# EasyEDA Pro project ProProject_LM5164 .epro

# Schematic Schematic1
Create Date: 2024-01-25; Page Name: P1; Project Name: LM5164; Schematic Name: Schematic1; Update Date: 2024-01-28; Company: 嘉立创EDA; Page Size: A4; Version: V1.0
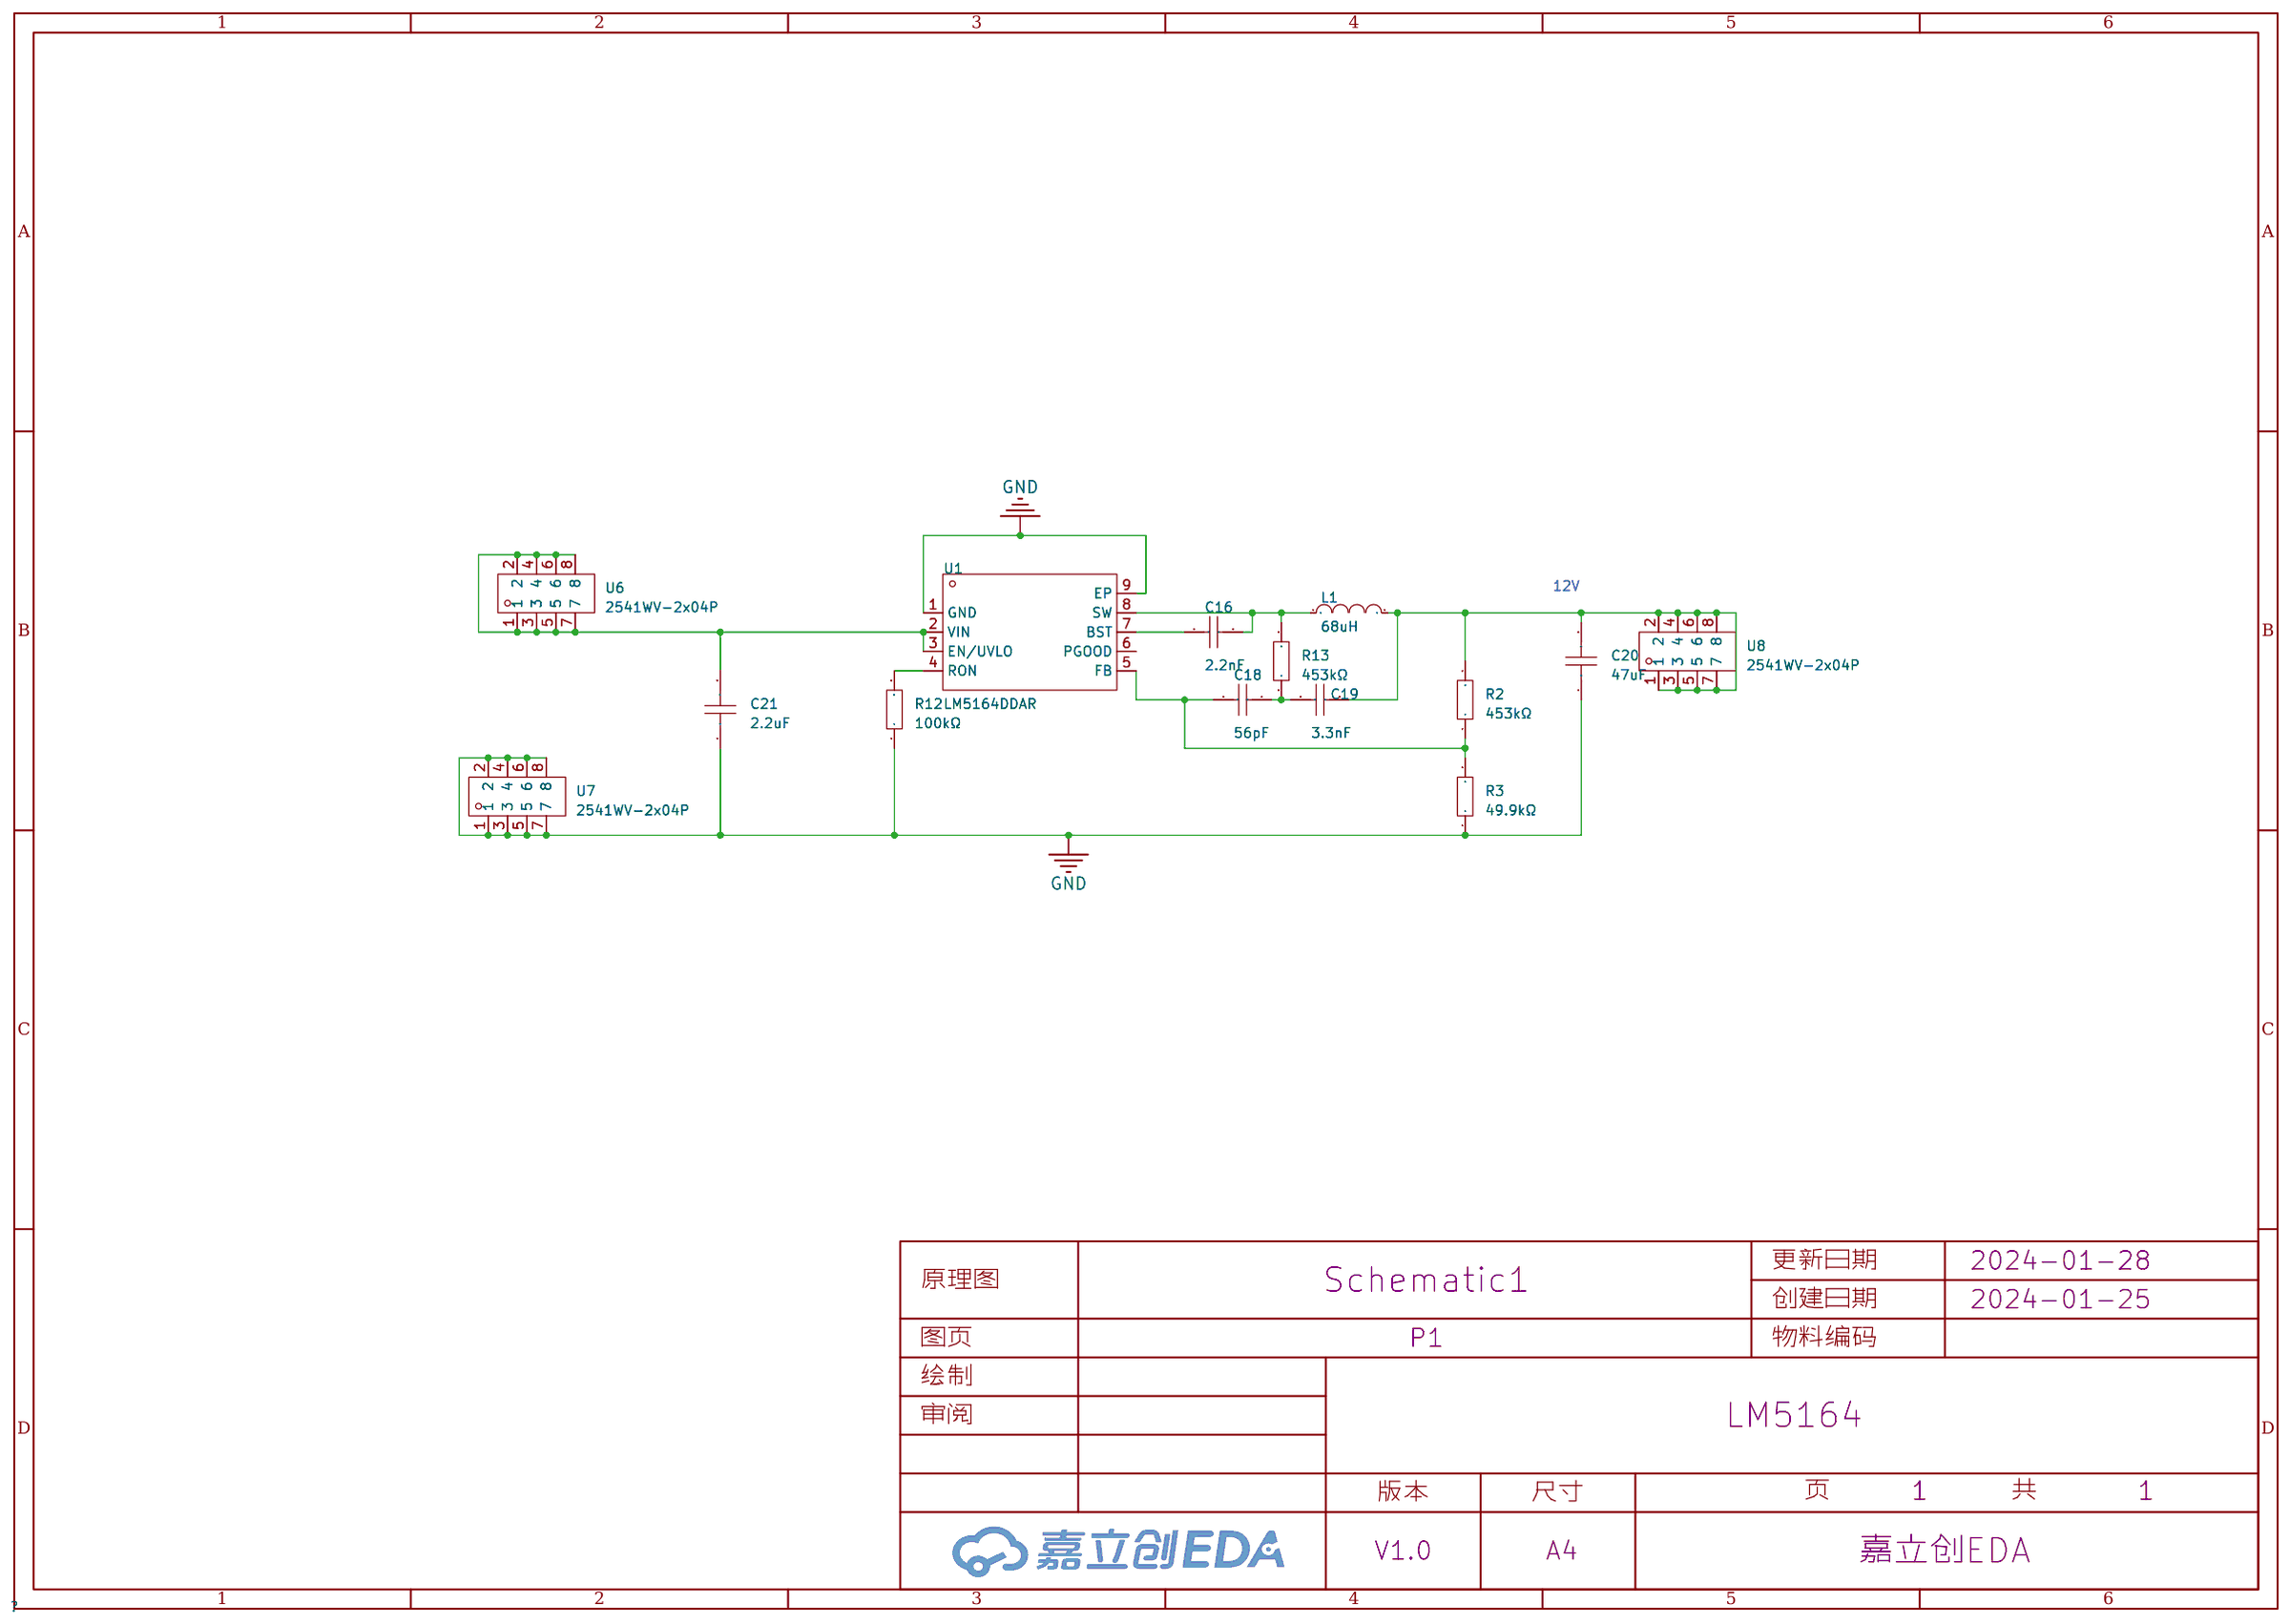
[diagram p0: schematic sheet]

## Parts
C16  2.2nF  [C0603]
C18  56pF  [C0603]
C19  3.3nF  [C0603]
C20  47uF  [C1206]
C21  2.2uF  [C1210]
L1  68uH  [IND-SMD_L12.6-W13.5]
R2  453kΩ  [R0603]
R3  49.9kΩ  [R0603]
R12  100kΩ  [R0603]
R13  453kΩ  [R0603]
U1  LM5164DDAR  [SO-8_L4.9-W3.9-P1.27-LS6.0-BL-EP]
U6  2541WV-2x04P  [HDR-TH_8P-P2.54-V-M-R2-C4-S2.54-3]
U7  2541WV-2x04P  [HDR-TH_8P-P2.54-V-M-R2-C4-S2.54-3]
U8  2541WV-2x04P  [HDR-TH_8P-P2.54-V-M-R2-C4-S2.54-3]

## Library data of the parts
C16 = 0603B222K500NT: 容值:2.2nF;精度:±10%;额定电压:50V;材质(温度系数):X7R;; LCSC Part Name: 2.2nF ±10% 50V; Supplier Part: C1604; Manufacturer: FH(风华); Supplier Footprint: 0603; JLCPCB Part Class: 基础库; Datasheet: https://atta.szlcsc.com/upload/public/pdf/source/20200305/C486355_26A10D38EF8C2A5C37091D0039909270.pdf; Supplier: LCSC; Tolerance: ±10%; Voltage Rated: 50V; Temperature Coefficient: X7R
C18 = 0603CG560J500NT: 容值:56pF;精度:±5%;额定电压:50V;材质(温度系数):C0G;; LCSC Part Name: 56pF ±5% 50V; Supplier Part: C1676; Manufacturer: FH(风华); Supplier Footprint: 0603; JLCPCB Part Class: Extended Part; Datasheet: https://atta.szlcsc.com/upload/public/pdf/source/20200305/C486355_26A10D38EF8C2A5C37091D0039909270.pdf; Supplier: LCSC; Tolerance: ±5%; Voltage Rated: 50V; Temperature Coefficient: C0G
C19 = CL10B332KB8NNNC: 容值:3.3nF;精度:±10%;额定电压:50V;材质(温度系数):X7R;; LCSC Part Name: 3.3nF ±10% 50V; Supplier Part: C1613; Manufacturer: SAMSUNG(三星); Supplier Footprint: 0603; JLCPCB Part Class: 基础库; Datasheet: https://atta.szlcsc.com/upload/public/pdf/source/20160218/1457707763339.pdf; Supplier: LCSC; Tolerance: ±10%; Voltage Rated: 50V; Temperature Coefficient: X7R
C20 = GRM31CR61E476ME44L: 容值:47uF;精度:±20%;额定电压:25V;材质(温度系数):X5R;; LCSC Part Name: 47uF ±20% 25V; Supplier Part: C403725; Manufacturer: muRata(村田); Supplier Footprint: 1206; JLCPCB Part Class: 扩展库; Datasheet: https://atta.szlcsc.com/upload/public/pdf/source/20191025/C403725_B8A8CD2FFA1F57E6FDF268BD106459D5.pdf; Supplier: LCSC; Tolerance: ±20%; Voltage Rated: 25V; Temperature Coefficient: X5R
C21 = 1210B225K101NT: 容值:2.2uF;精度:±10%;额定电压:100V;材质(温度系数):X7R;; LCSC Part Name: 2.2uF ±10% 100V; Supplier Part: C962231; Manufacturer: FH(风华); Supplier Footprint: 1210; JLCPCB Part Class: 扩展库; Datasheet: https://atta.szlcsc.com/upload/public/pdf/source/20200107/C481765_0B9ED27549D69467445AE1EDB69BAE8E.pdf; Supplier: LCSC; Tolerance: ±10%; Voltage Rated: 100V; Temperature Coefficient: X7R
L1 = FXL1360-680-M: 电感值:68uH;精度:±20%;额定电流:3A;类型:一体成型电感;饱和电流(Isat):4.5A;; LCSC Part Name: 68uH ±20% 4.5A; Supplier Part: C526032; Manufacturer: cjiang(长江微电); Supplier Footprint: SMD,12.6x13.5mm; JLCPCB Part Class: 扩展库; Datasheet: https://atta.szlcsc.com/upload/public/pdf/source/20230516/EDBB5FB099B441B256CFB4945AE848AD.pdf; Supplier: LCSC; Tolerance: ±20%; Rated Current: 3A; Type: 一体成型电感; DC Resistance (DCR): 140mΩ; Saturation Current (Isat): 4.5A
R2 R13 = 0603WAF4533T5E: 阻值:453kΩ;精度:±1%;功率:100mW;温度系数:±100ppm/℃;电阻类型:厚膜电阻;; LCSC Part Name: 453kΩ ±1% 100mW 厚膜电阻; Supplier Part: C25818; Manufacturer: UNI-ROYAL(厚声); Supplier Footprint: 0603; JLCPCB Part Class: 扩展库; Datasheet: https://atta.szlcsc.com/upload/public/pdf/source/20200306/C422600_1E6D84923E4A46A82E41ADD87F860B5C.pdf; Supplier: LCSC; Tolerance: ±1%; Power(Watts): 100mW; Overload Voltage (Max): 75V; Temperature Coefficient: ±100ppm/℃; Type: 厚膜电阻; Operating Temperature Range: -55℃~+155℃
R3 = 0603WAF4992T5E: 阻值:49.9kΩ;精度:±1%;功率:100mW;温度系数:±100ppm/℃;电阻类型:厚膜电阻;; LCSC Part Name: 49.9kΩ ±1% 100mW 厚膜电阻; Supplier Part: C23184; Manufacturer: UNI-ROYAL(厚声); Supplier Footprint: 0603; JLCPCB Part Class: Basic Part; Datasheet: https://atta.szlcsc.com/upload/public/pdf/source/20200306/C422600_1E6D84923E4A46A82E41ADD87F860B5C.pdf; Supplier: LCSC; Tolerance: ±1%; Power(Watts): 100mW; Overload Voltage (Max): 75V; Temperature Coefficient: ±100ppm/℃; Type: 厚膜电阻; Operating Temperature Range: -55℃~+155℃
R12 = RC0603FR-07100KL: 电阻类型:厚膜电阻;阻值:100kΩ;精度:±1%;功率:100mW;最大工作电压:75V;温度系数:±100ppm/℃;; LCSC Part Name: 厚膜电阻 100kΩ ±1% 100mW; Supplier Part: C14675; Manufacturer: YAGEO(国巨); Supplier Footprint: 0603; JLCPCB Part Class: Extended Part; Datasheet: https://atta.szlcsc.com/upload/public/pdf/source/20140324/1457707028752.pdf; Supplier: LCSC; Type: 厚膜电阻; Tolerance: ±1%; Power(Watts): 100mW; Overload Voltage (Max): 75V; Temperature Coefficient: ±100ppm/℃; Operating Temperature Range: -55℃~+155℃
U1 = LM5164DDAR: 功能类型:降压型;输出类型:可调;输入电压:6V~100V;输出电压:1.2V~100V;输出电流(最大值):1A;; LCSC Part Name: 降压型 输入6V~100V 输出1.2V~100V 1A; Supplier Part: C477928; Manufacturer: TI(德州仪器); Supplier Footprint: SO-8-EP; JLCPCB Part Class: 扩展库; Datasheet: https://atta.szlcsc.com/upload/public/pdf/source/20200102/C477928_A6130A40DCA2C193067E68A47DE8CF0C.pdf; Supplier: LCSC; Function: 降压型; Synchronous Rectification: 是; Output Type: 可调; Number of Outputs: 1; Topology: 降压式; Input Voltage: 6V~100V; Output Voltage: 1.2V~100V; Output Current (Max): 1A; Switching Frequency: 1MHz; Operating Temperature: -40℃~+150℃@(TJ)
U6-U8 = 2541WV-2x04P: 插针结构:2x4P;间距:2.54mm;安装类型:直插;排数:双排;总PIN位数:8P;配合针长度:6mm;塑高:2.54mm;端接针长度:3mm;; Supplier Part: C5383105; Manufacturer: HanElectricity(瀚源); Supplier Footprint: 插件,P=2.54mm; Datasheet: https://atta.szlcsc.com/upload/public/pdf/source/20230330/E6AE37B56C45D0CDA24B058754300644.pdf; Supplier: LCSC; Pin Structure: 2x4P; Pitch: 2.54mm; Mounting Type: 直插; Number of Rows: 双排; Number of Pins: 8P; Length of Mating Pin: 6mm; Insulation Height: 2.54mm; Length of End Connection Pin: 3mm

## Nets
GND: C20.1 C21.1 R3.1 R12.1 U1.1(GND) U1.9(EP) U7.1 U7.2 U7.3 U7.4 U7.5 U7.6 U7.7 U7.8
$1N232: C16.1 U1.7(BST)
$1N237: C16.2 L1.1 R13.2 U1.8(SW)
$1N1019: R12.2 U1.4(RON)
$1N4223: C18.2 C19.1 R13.1
$1N4227: C18.1 R2.1 R3.2 U1.5(FB)
$1N4823: C21.2 U1.2(VIN) U1.3(EN/UVLO) U6.1 U6.2 U6.3 U6.4 U6.5 U6.6 U6.7 U6.8
$1N5083: C19.2 C20.2 L1.2 R2.2 U8.1 U8.2 U8.3 U8.4 U8.5 U8.6 U8.7 U8.8

Not connected (* = marked no-connect by the designer): U1 6(PGOOD)

## Notes on the sheet
- 12V

# Schematic Schematic2
Create Date: 2024-03-01; Page Name: P1; Project Name: LM5164; Schematic Name: Schematic2; Update Date: 2024-03-01; Company: 嘉立创EDA; Page Size: A4; Version: V1.0
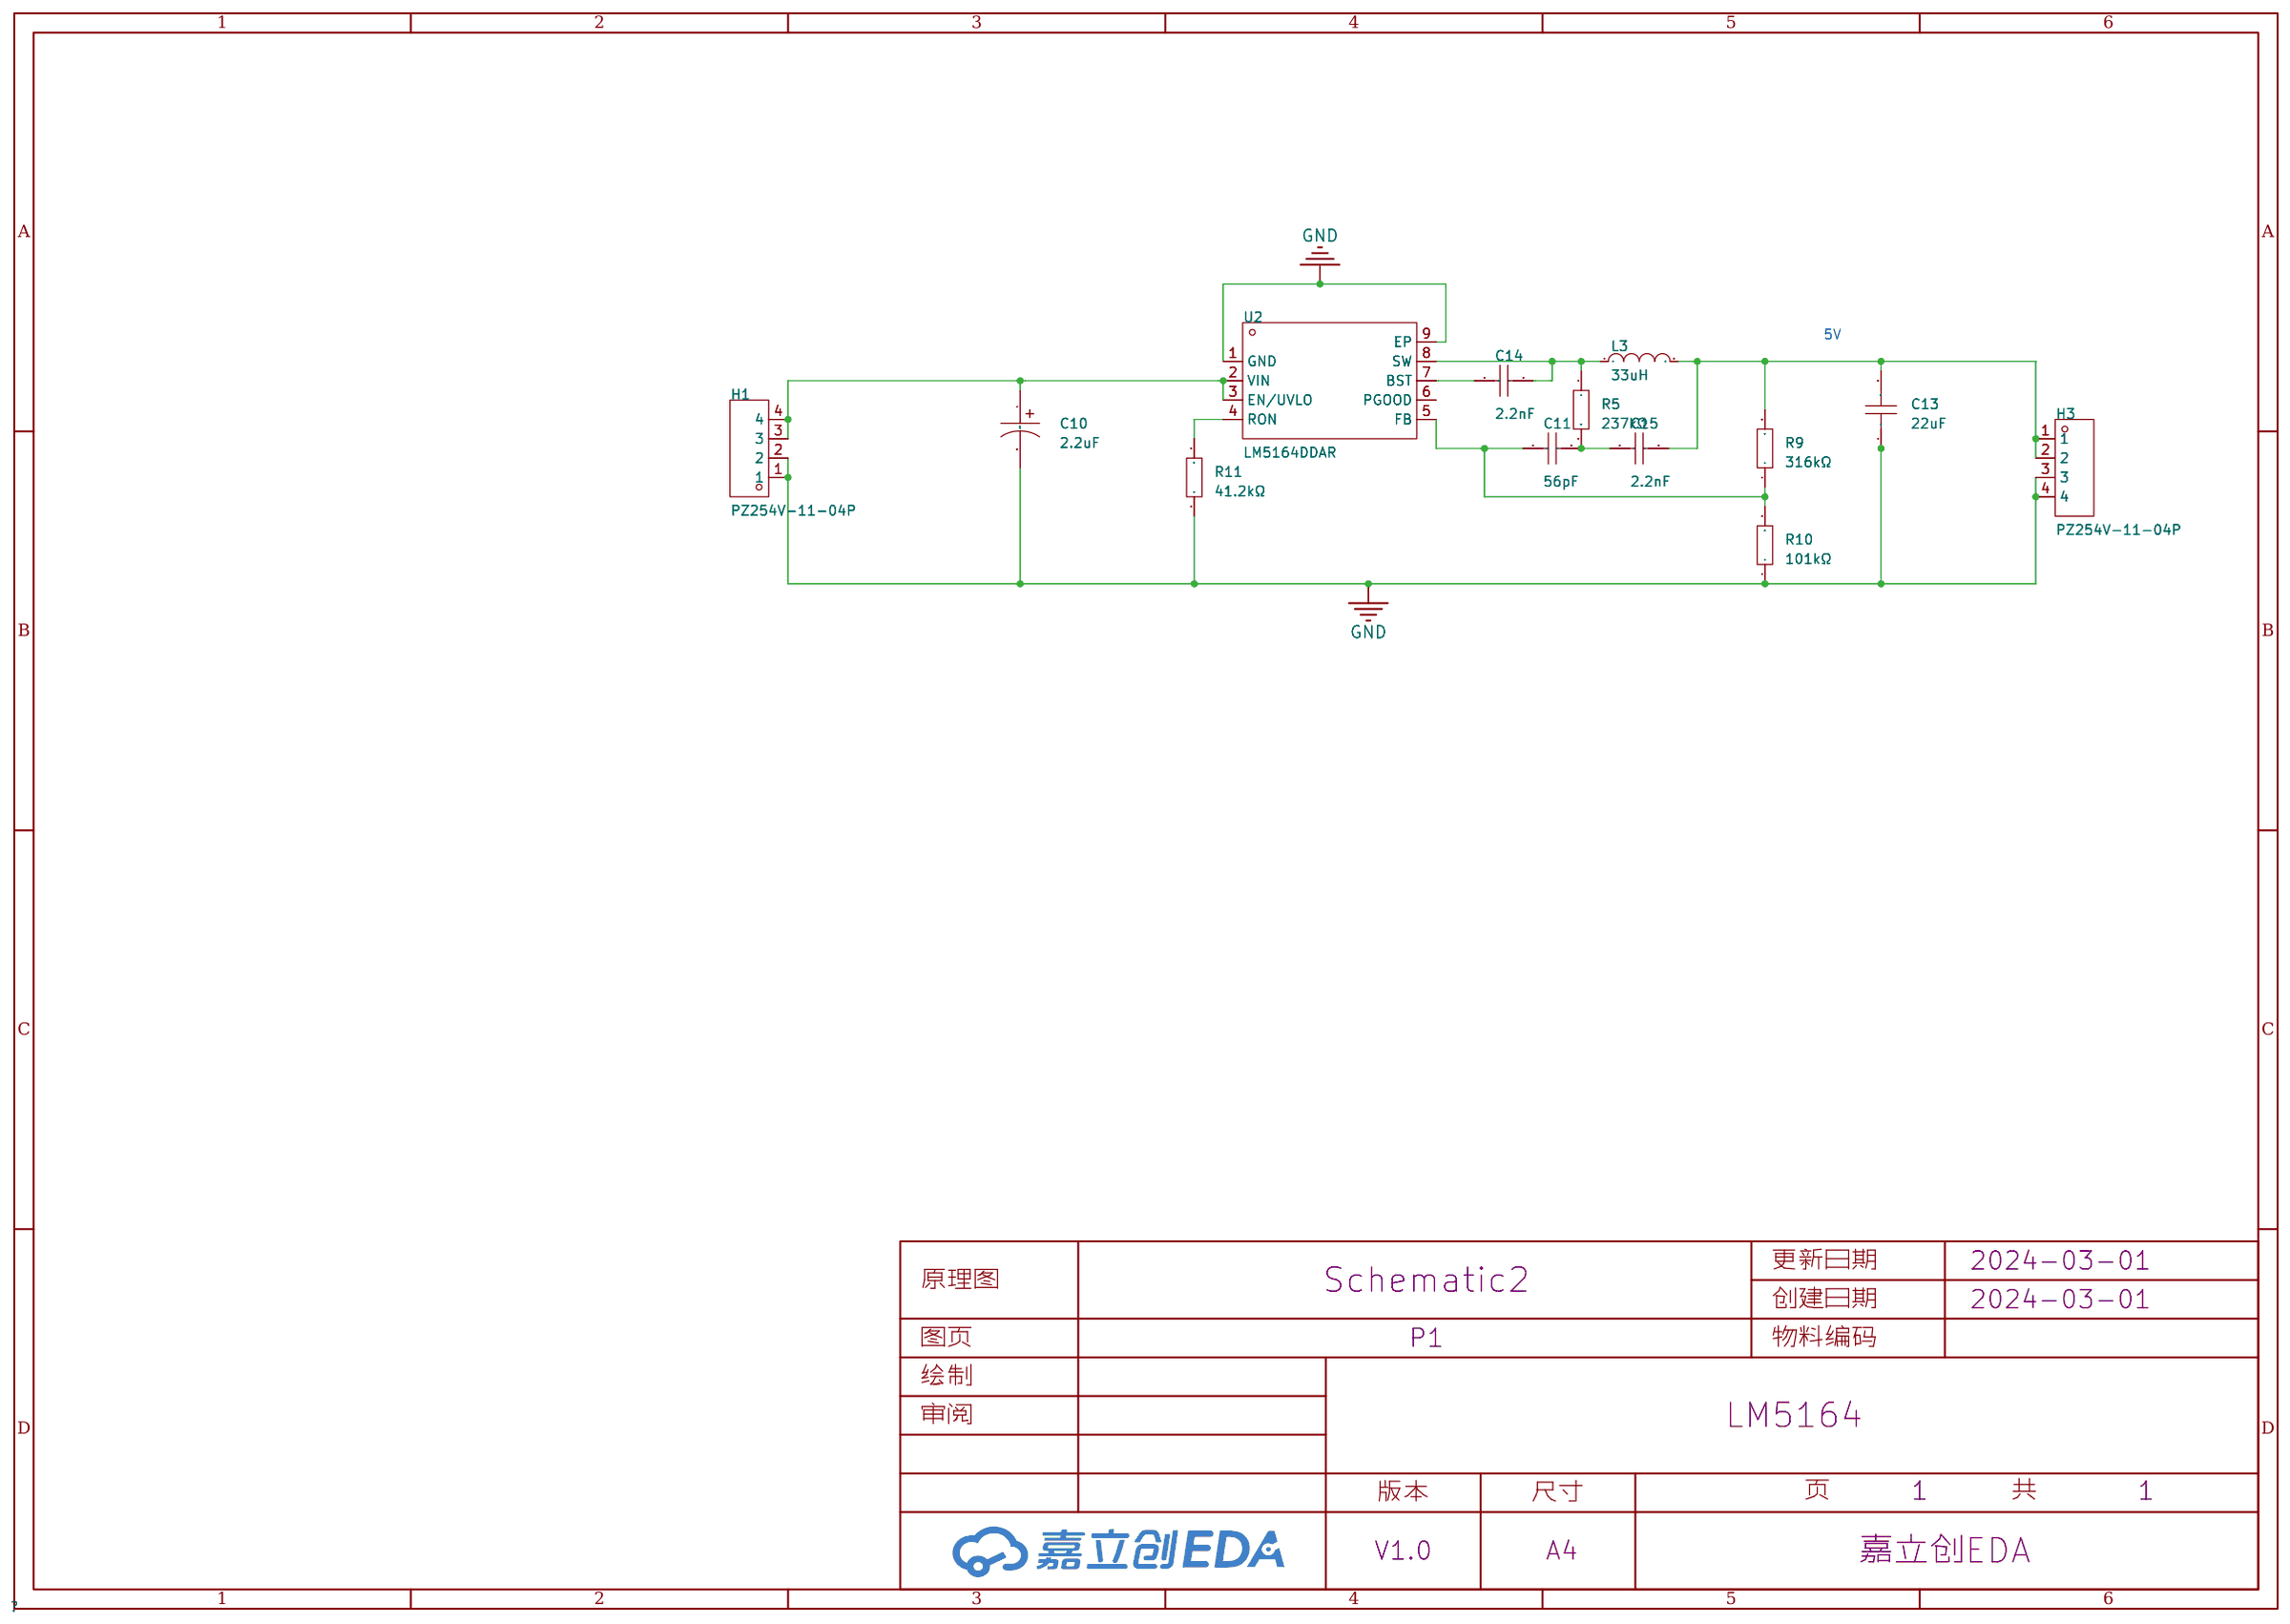
[diagram p1: schematic sheet]

## Parts
C10  2.2uF  [CAP-TH_BD6.3-P2.50-D1.0-FD]
C11  56pF  [C0603]
C13  22uF  [C0603]
C14  2.2nF  [C0603]
C15  2.2nF  [C0603]
H1  PZ254V-11-04P  [HDR-TH_4P-P2.54-V-M]
H3  PZ254V-11-04P  [HDR-TH_4P-P2.54-V-M]
L3  33uH  [IND-SMD_L11.5-W10.0_FXL1040]
R5  237kΩ  [R1206]
R9  316kΩ  [R0603]
R10  101kΩ  [R0603]
R11  41.2kΩ  [R0603]
U2  LM5164DDAR  [SO-8_L4.9-W3.9-P1.27-LS6.0-BL-EP]

## Library data of the parts
C10 = ECG2GM2R2E09OTBO: 容值:2.2uF;精度:±20%;额定电压:400V;纹波电流:70mA@100kHz;等效串联电阻:-;; LCSC Part Name: 2.2uF ±20% 400V; Supplier Part: C525475; Manufacturer: Yunxing(云星); Supplier Footprint: 插件,D6.3xL9mm; JLCPCB Part Class: 扩展库; Datasheet: https://atta.szlcsc.com/upload/public/pdf/source/20200506/C525419_5DB4C0F9B5E6E2AFEBB1800A1F09D9CB.pdf; Supplier: LCSC; Tolerance: ±20%; Rated Voltage: 400V; Ripple Current: 70mA@100kHz; Lead Spacing: 2.5mm; φD: 6.3mm; L: 9mm; Lifetime @ Temp: 8000hrs@105℃
C11 = 0603CG560J500NT: 容值:56pF;精度:±5%;额定电压:50V;材质(温度系数):C0G;; LCSC Part Name: 56pF ±5% 50V; Supplier Part: C1676; Manufacturer: FH(风华); Supplier Footprint: 0603; JLCPCB Part Class: Extended Part; Datasheet: https://atta.szlcsc.com/upload/public/pdf/source/20200305/C486355_26A10D38EF8C2A5C37091D0039909270.pdf; Supplier: LCSC; Tolerance: ±5%; Voltage Rated: 50V; Temperature Coefficient: C0G
C13 = CL10A226MP8NUNE: 容值:22uF;精度:±20%;额定电压:10V;材质(温度系数):X5R;; LCSC Part Name: 22uF ±20% 10V; Supplier Part: C86295; Manufacturer: SAMSUNG(三星); Supplier Footprint: 0603; JLCPCB Part Class: 扩展库; Datasheet: https://atta.szlcsc.com/upload/public/pdf/source/20160218/1457707763339.pdf; Supplier: LCSC; Tolerance: ±20%; Voltage Rated: 10V; Temperature Coefficient: X5R
C14 C15 = 0603B222K500NT: 容值:2.2nF;精度:±10%;额定电压:50V;材质(温度系数):X7R;; LCSC Part Name: 2.2nF ±10% 50V; Supplier Part: C1604; Manufacturer: FH(风华); Supplier Footprint: 0603; JLCPCB Part Class: 基础库; Datasheet: https://atta.szlcsc.com/upload/public/pdf/source/20200305/C486355_26A10D38EF8C2A5C37091D0039909270.pdf; Supplier: LCSC; Tolerance: ±10%; Voltage Rated: 50V; Temperature Coefficient: X7R
H1 H3 = PZ254V-11-04P: 插针结构:1x4P;间距:2.54mm;行距:-;圆针/方针:方针;安装类型:直插;排数:单排;总PIN位数:4P;额定电流:3A;额定电压:250V;配合针长度:6mm;塑高:2.5mm;端接针长度:3mm;触头材质:-;工作温度范围:-40℃~+105℃;颜色:黑色;; LCSC Part Name: 间距:2.54mm 1x4P 直插 方针; Supplier Part: C2691448; Manufacturer: XFCN(兴飞); Supplier Footprint: 插件,P=2.54mm; JLCPCB Part Class: Extended Part; Datasheet: https://atta.szlcsc.com/upload/public/pdf/source/20200309/C492403_F9F19131791D08044AD4F84F8E751A34.pdf; Supplier: LCSC; Pin Structure: 1x4P; Pitch: 2.54mm; Circluar Pins/Square Pins: 方针; Mounting Type: 直插; Number of Rows: 单排; Number of Pins: 4P; Current Rating (Max): 3A; Voltage Rating (Max): 250V; Length of Mating Pin: 6mm; Insulation Height: 2.5mm; Length of End Connection Pin: 3mm; Operating Temperature Range: -40℃~+105℃; Color: 黑色
L3 = FXL1040-330-M: 电感值:33uH;精度:±20%;额定电流:4.4A;类型:一体成型电感;饱和电流(Isat):5A;; LCSC Part Name: 33uH ±20% 5A; Supplier Part: C475918; Manufacturer: cjiang(长江微电); Supplier Footprint: SMD,11.5x10mm; JLCPCB Part Class: Extended Part; Datasheet: https://atta.szlcsc.com/upload/public/pdf/source/20230516/54757DC4DB76FADFA619F78143C06647.pdf; Supplier: LCSC; Tolerance: ±20%; Rated Current: 4.4A; Type: 一体成型电感; DC Resistance (DCR): 92mΩ; Saturation Current (Isat): 5A
R5 = AC1206FR-07237KL: 电阻类型:厚膜电阻;阻值:237kΩ;精度:±1%;功率:250mW;; LCSC Part Name: 237kΩ ±1% 250mW; Supplier Part: C229460; Manufacturer: YAGEO(国巨); Supplier Footprint: 1206; JLCPCB Part Class: Extended Part; Datasheet: https://atta.szlcsc.com/upload/public/pdf/source/20181031/C229460_1A98B15B0CC15D98A77C402CC2DB04DA.pdf; Supplier: LCSC; Type: 厚膜电阻; Tolerance: ±1%; Power(Watts): 250mW; Temperature Coefficient: ±100ppm/℃; Overload Voltage (Max): 200V; Operating Temperature Range: -55℃~+155℃
R9 R10 = 0603WAF3163T5E: 阻值:316kΩ;精度:±1%;功率:100mW;温度系数:±100ppm/℃;电阻类型:厚膜电阻;; LCSC Part Name: 316kΩ ±1% 100mW 厚膜电阻; Supplier Part: C25814; Manufacturer: UNI-ROYAL(厚声); Supplier Footprint: 0603; JLCPCB Part Class: Extended Part; Datasheet: https://atta.szlcsc.com/upload/public/pdf/source/20200306/C422600_1E6D84923E4A46A82E41ADD87F860B5C.pdf; Supplier: LCSC; Tolerance: ±1%; Power(Watts): 100mW; Overload Voltage (Max): 75V; Temperature Coefficient: ±100ppm/℃; Type: 厚膜电阻; Operating Temperature Range: -55℃~+155℃
R11 = 0603WAF4122T5E: 阻值:41.2kΩ;精度:±1%;功率:100mW;温度系数:±100ppm/℃;电阻类型:厚膜电阻;; LCSC Part Name: 41.2kΩ ±1% 100mW 厚膜电阻; Supplier Part: C23166; Manufacturer: UNI-ROYAL(厚声); Supplier Footprint: 0603; JLCPCB Part Class: Extended Part; Datasheet: https://atta.szlcsc.com/upload/public/pdf/source/20200306/C422600_1E6D84923E4A46A82E41ADD87F860B5C.pdf; Supplier: LCSC; Tolerance: ±1%; Power(Watts): 100mW; Overload Voltage (Max): 75V; Temperature Coefficient: ±100ppm/℃; Type: 厚膜电阻; Operating Temperature Range: -55℃~+155℃
U2 = LM5164DDAR: 功能类型:降压型;输出类型:可调;输入电压:6V~100V;输出电压:1.2V~100V;输出电流(最大值):1A;; LCSC Part Name: 降压型 输入6V~100V 输出1.2V~100V 1A; Supplier Part: C477928; Manufacturer: TI(德州仪器); Supplier Footprint: SO-8-EP; JLCPCB Part Class: 扩展库; Datasheet: https://atta.szlcsc.com/upload/public/pdf/source/20200102/C477928_A6130A40DCA2C193067E68A47DE8CF0C.pdf; Supplier: LCSC; Function: 降压型; Synchronous Rectification: 是; Output Type: 可调; Number of Outputs: 1; Topology: 降压式; Input Voltage: 6V~100V; Output Voltage: 1.2V~100V; Output Current (Max): 1A; Switching Frequency: 1MHz; Operating Temperature: -40℃~+150℃@(TJ)

## Nets
GND: C10.2 C13.1 H1.1 H1.2 H3.3 H3.4 R10.1 R11.1 U2.1(GND) U2.9(EP)
Net-(C10-1): C10.1 H1.3 H1.4 U2.2(VIN) U2.3(EN/UVLO)
Net-(C11-1): C11.1 R9.1 R10.2 U2.5(FB)
Net-(C11-2): C11.2 C15.1 R5.2
Net-(C13-2): C13.2 C15.2 H3.1 H3.2 L3.2 R9.2
Net-(C14-1): C14.1 U2.7(BST)
Net-(C14-2): C14.2 L3.1 R5.1 U2.8(SW)
Net-(R11-2): R11.2 U2.4(RON)

Not connected (* = marked no-connect by the designer): U2 6(PGOOD)

## Notes on the sheet
- 5V

# Board PCB2
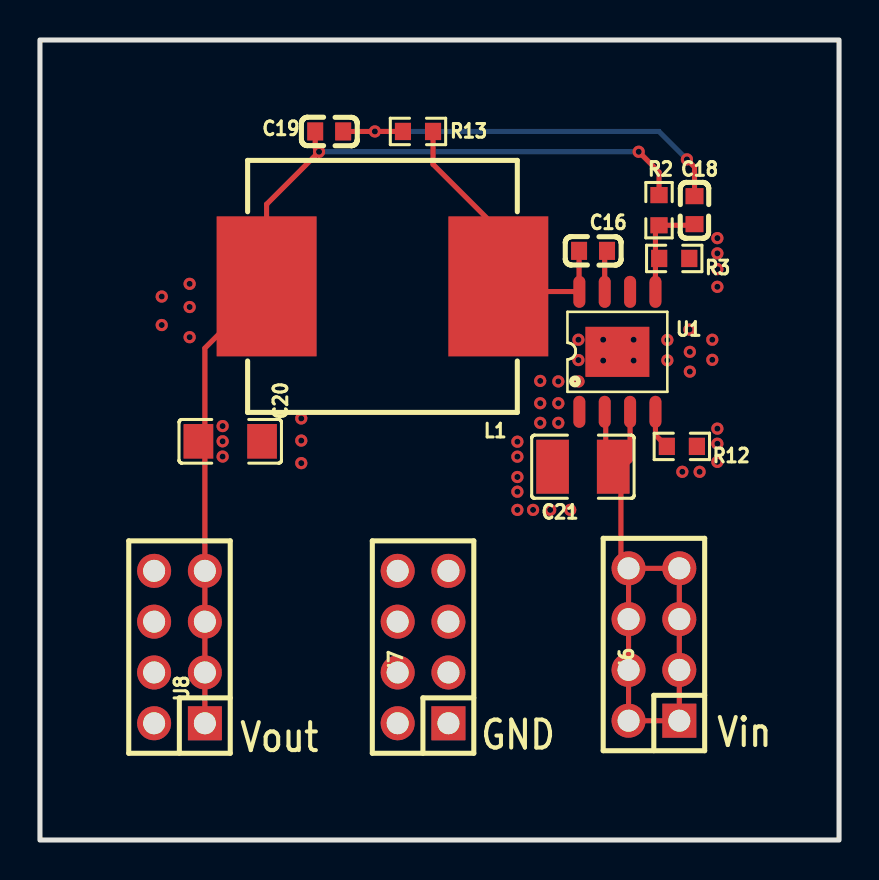
[diagram p2: board, top side]
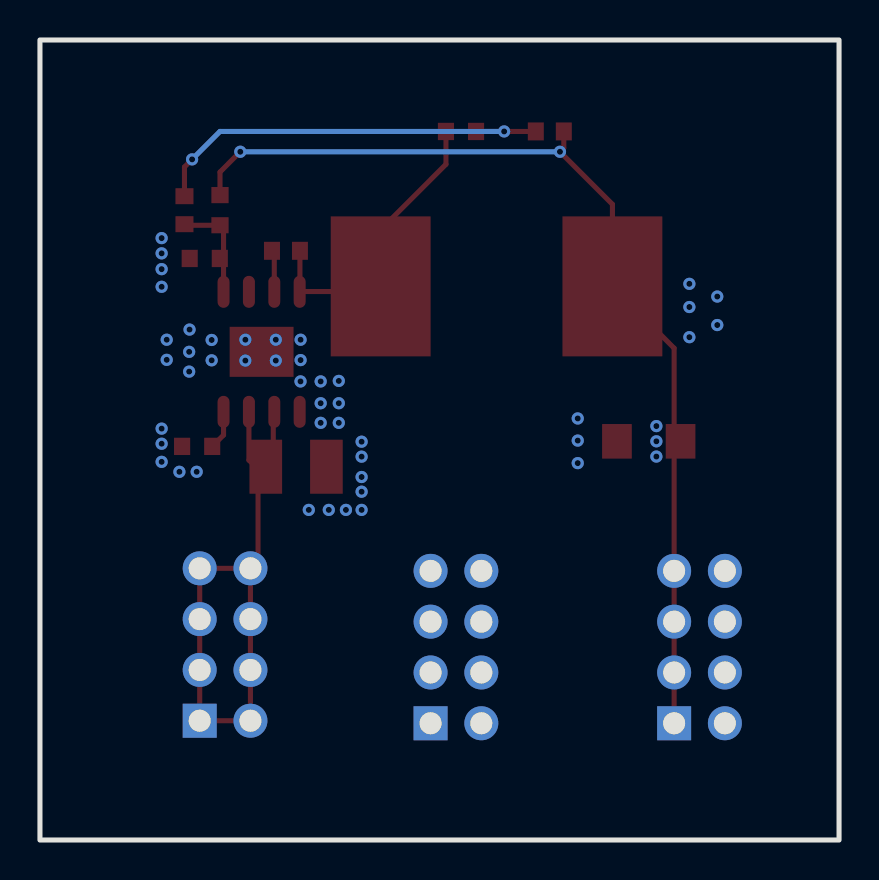
[diagram p3: board, bottom side, seen from below]

Outline 40 x 40 mm; copper layers: Top Layer, Bottom Layer. Coordinates in mm from the lower left corner of the outline.
Outline path: rectangle 0,40 40,0
Stack: Top Layer 0.035mm / Dielectric1 1.51mm FR4 er 4.5 / Bottom Layer 0.035mm

## Design rules (mm)
template: 自定义配置
spacing copperThickness1oz (default): track to track 0.102, other pairs 0.152 to 0.3
spacing copperThickness2oz: track to track 0.203, other pairs 0.152 to 0.3
track width copperThickness1oz (default): min 0.127, default 0.254, max 2.54
track width copperThickness2oz: min 0.203, default 0.254, max 2.54
differential pair differentialPair (default): width min 0.127, default 0.254, max 2.54; gap min 0.152, default 0.152
via viaSize (default): diameter min 0.5, default 0.61, max 10; hole min 0.3, default 0.305, max 6.3

## Placement (name value [footprint] x y rotation side)
C16  2.2nF  [C0603]  27.69 29.46 180 top
C18  56pF  [C0603]  32.77 31.49 90 top
C19  3.3nF  [C0603]  14.48 35.43 180 top
C20  47uF  [C1206]  9.52 19.93 180 top
C21  2.2uF  [C1210]  27.18 18.66 0 top
L1  68uH  [IND-SMD_L12.6-W13.5]  17.14 27.68 180 top
R2  453kΩ  [R0603]  30.99 31.49 90 top
R3  49.9kΩ  [R0603]  31.75 29.08 180 top
R12  100kΩ  [R0603]  32.13 19.68 180 top
R13  453kΩ  [R0603]  18.92 35.43 0 top
U1  LM5164DDAR  [SO-8_L4.9-W3.9-P1.27-LS6.0-BL-EP]  28.9 24.41 0 top
U6  2541WV-2x04P  [HDR-TH_8P-P2.54-V-M-R2-C4-S2.54-3]  30.73 9.77 90 top
U7  2541WV-2x04P  [HDR-TH_8P-P2.54-V-M-R2-C4-S2.54-3]  19.18 9.65 90 top
U8  2541WV-2x04P  [HDR-TH_8P-P2.54-V-M-R2-C4-S2.54-3]  6.98 9.65 90 top

## Footprints (pads in the part's own frame, mm; a bottom-side part is the same pattern mirrored in y, then rotated)
C0603
  rect 0.8x0.9 smd: 1(-0.7,0) 2(0.7,0)
C1206
  rect 1.485x1.728 smd: 1(-1.593,0) 2(1.593,0)
C1210
  rect 1.635x2.7 smd: 1(-1.518,0) 2(1.518,0)
HDR-TH_8P-P2.54-V-M-R2-C4-S2.54-3
  rect 1.7x1.7 hole 1.1: 1(-3.81,-1.27)
  round 1.7 hole 1.1: 2(-3.81,1.27) 3(-1.27,-1.27) 4(-1.27,1.27) 5(1.27,-1.27) 6(1.27,1.27) 7(3.81,-1.27) 8(3.81,1.27)
IND-SMD_L12.6-W13.5
  rect 5x7 smd: 1(-5.8,0) 2(5.8,0)
R0603
  rect 0.806x0.864 smd: 1(-0.753,0) 2(0.753,0)
SO-8_L4.9-W3.9-P1.27-LS6.0-BL-EP
  oval 0.6x1.6 smd: 1(-1.905,-3) 2(-0.635,-3) 3(0.635,-3) 4(1.905,-3) 5(1.905,3) 6(0.635,3) 7(-0.635,3) 8(-1.905,3)
  rect 3.2x2.5 smd: 9(0,0)

## Nets
As in the schematic.

Pads without a net: U1 6

## Via types
v1: diameter 0.61, hole 0.305, Top Layer to Bottom Layer, 52 vias

## Routing (per net, layer and track width the routed paths; a pad name or vN(x,y) marks a point on that pad's centre or on a via; arc(x,y) is an arc through that point)
GND:
  vias: v1(13.08,21.08) v1(13.08,19.97) v1(13.08,18.84) v1(23.9,19.92) v1(23.9,19.17) v1(23.9,18.15) v1(23.9,17.41) v1(23.9,16.5) v1(24.68,16.5) v1(25.04,22.95) v1(25.04,21.84) v1(25.04,20.86) v1(25.54,16.5) v1(25.95,22.93) v1(25.95,21.84) v1(25.95,20.86) v1(26.54,16.5) v1(26.95,25.01) v1(26.95,24) v1(26.96,22.93) v1(28.19,25.01) v1(28.19,23.97) v1(29.72,25.01) v1(29.72,23.97) v1(31.4,25) v1(31.4,23.98) v1(32.16,18.41) v1(32.51,25.52) v1(32.53,24.41) v1(32.53,23.42) v1(33.02,18.41) v1(33.65,25.01) v1(33.65,24.01) v1(33.91,30.09) v1(33.91,29.33) v1(33.91,28.54) v1(33.91,27.66) v1(33.91,20.57) v1(33.91,19.81) v1(33.91,18.91)
$1N232: length 2.1
  Top Layer w0.254: C16.1 28.27,29.34 U1.7
$1N237: length 15.3
  Top Layer w0.254: 26.99,27.42 U1.8 ; 26.99,27.42 23.2,27.42 L1.1 22.95,30.52 19.68,33.79 R13.2 ; 26.99,27.42 C16.2
$1N1019: length 2
  Top Layer w0.254: U1.4 30.81,20.25 R12.2
$1N4223: length 21.2
  Top Layer w0.254: C19.1 v1(16.76,35.43) R13.1 ; C18.2 32.77,33.65 v1(32.39,34.03)
  Bottom Layer w0.254: v1(16.76,35.43) 30.99,35.43 v1(32.39,34.03)
$1N4227: length 5.2
  Top Layer w0.254: U1.5 30.81,30.56 R2.1 32.71,30.74 C18.1
$1N4823: length 31.7
  Top Layer w0.254: 29.54,21.41 29.54,18.99 29.08,18.54 ; 29.08,18.54 29.08,13.97 U6.8 ; 29.08,18.54 28.32,19.3 28.32,21.36 U1.2 ; U6.8 U6.6 U6.4 U6.2 U6.1 U6.3 U6.5 U6.7 U6.8
$1N5083: length 50.6
  Top Layer w0.254: C19.2 13.78,34.6 v1(13.97,34.41) 11.34,31.79 L1.2 8.26,24.59 U8.7 U8.5 U8.3 U8.1 ; v1(29.97,34.41) 30.99,33.4 R2.2
  Bottom Layer w0.254: v1(13.97,34.41) v1(29.97,34.41)
  vias: v1(6.1,27.17) v1(6.1,25.75) v1(7.49,27.81) v1(7.49,26.65) v1(7.49,25.14) v1(9.14,20.7) v1(9.14,19.93) v1(9.14,19.17)

## Copper pours and planes (outline as drawn; the poured copper is in the pictures)
GND on Top Layer: 2.79,37.08 37.29,37.08 37.29,2.79 2.79,2.79
GND on Bottom Layer: 2.79,37.08 37.08,37.08 37.08,2.59 2.79,2.59
$1N237 on Top Layer: 20.45,24.12 25.53,24.12 26.04,24.63 26.04,26.41 26.16,26.54 27.18,26.54 27.18,30.73 26.67,31.24 24.89,31.24 20.45,26.79
$1N4823 on Top Layer: 33.27,4.34 33.27,14.85 29.99,18.14 29.99,21.93 29.64,22.28 28.14,22.28 27.81,21.96 27.81,4.57 28.04,4.34
$1N5083 on Top Layer: 4.45,4.34 9.52,4.34 9.52,21.03 12.75,24.25 13.84,24.25 13.84,33.85 5.03,33.85 4.45,33.27
$1N5083 on Bottom Layer: 4.45,4.34 9.52,4.34 9.52,21.03 12.75,24.25 13.84,24.25 13.84,33.85 5.03,33.85 4.45,33.27

## Text on the board
Top Silkscreen Layer: Vout | GND | Vin
